# Altium schematic sheet SH5 - RGB LED.SchDoc: RGB LED
size B; CheckedBy: Wolfgang Windholtz; Engineer: Sahil Kale; Revision: 1.0; SheetNumber: 5; SheetTotal: 7
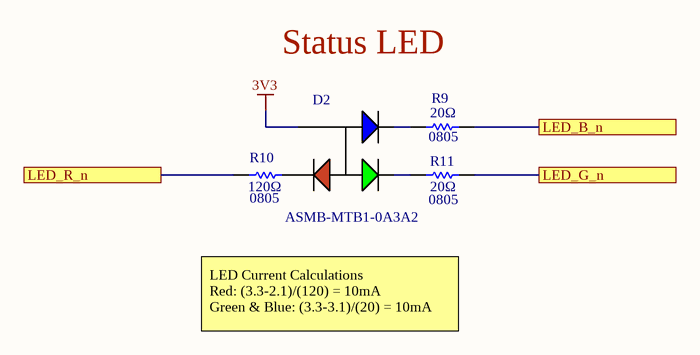
[diagram p0: SH5 - RGB LED.SchDoc]

## Parts
D2  Manufacturer Part Number 1: ASMB-MTB1-0A3A2  [LED_RGB]  (hidden comment: LED_RGB)
R9  value 20Ω  Package/Footprint: 0805  [RESC0805]  (hidden comment: RES_20Ω_0805_1%)
R10  value 120Ω  Package/Footprint: 0805  [RESC0805]  (hidden comment: RES_120Ω_0805_1%)
R11  value 20Ω  Package/Footprint: 0805  [RESC0805]  (hidden comment: RES_20Ω_0805_1%)

## Ports
LED_B_n, LED_G_n, LED_R_n

## Nets
3V3: D2.4(COMMON_ANODE)
LED_B_n: R9.2 ; port LED_B_n
LED_G_n: R11.2 ; port LED_G_n
LED_R_n: R10.1 ; port LED_R_n
NetD2_1: D2.1(CATHODE_(RED)) R10.2
NetD2_2: D2.2(CATHODE_(GREEN)) R11.1
NetD2_3: D2.3(CATHODE_(BLUE)) R9.1

## Notes on the sheet
- Status LED
- LED Current Calculations
  Red: (3.3-2.1)/(120) = 10mA
  Green & Blue: (3.3-3.1)/(20) = 10mA
- Title:
- Project:
- Date:
- Rev:
- Checker:
- Engineer:
- Sheet:
- of

## Library data of the parts
D2 = LED_RGB: LED RGB DIFFUSED 4PLCC SMD; Manufacturer 1: Broadcom; Color: Blue,Green,Red; Lens Color: White; Viewing Angle: 115°; Lens Style: Round; Luminous Intensity: 350mcd; Dominant Wavelength: 470nm; Forward Voltage: 3.1V; Test Current: 20mA; Package/Footprint: 4-PLCC; Supplier 1: Digi-Key; Number of Pins: 4; Lens Transparency: Diffused; Supplier Part Number 1: 516-3280-1-ND; Mounting Type: SMD
R9 R11 = RES_20Ω_0805_1%: RES 20 OHM 1% 1/8W 0805; Manufacturer 1: Yageo; Manufacturer Part Number 1: RC0805FR-0720RL; Supplier Part Number 1: 311-20.0CRCT-ND; Supplier 1: Digi-Key; Mounting Type: SMD; LCSC Part #: C17581
R10 = RES_120Ω_0805_1%: RES 120 OHM 1% 1/8W 0805; Manufacturer 1: Vishay; Manufacturer Part Number 1: CRCW0805120RFKEA; Supplier Part Number 1: 541-120CCT-ND; Supplier 1: Digi-Key; Mounting Type: SMD; LCSC Part #: C17437